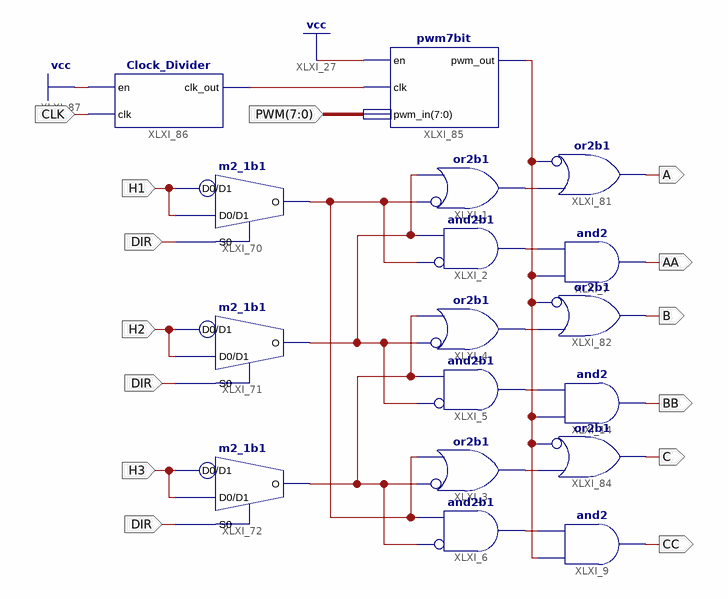
[diagram p0: schematic sheet 1]
// Xilinx ISE schematic openloop7bit.sch (spartan6) as structural Verilog: 17 symbols, 12 ports
module openloop7bit (
  input  [7:0] PWM,
  input  H1,
  input  H2,
  input  H3,
  input  DIR,
  input  CLK,
  output A,
  output AA,
  output B,
  output BB,
  output C,
  output CC
);

  wire H_1, H_2, H_3, XLXN_7, XLXN_8, XLXN_9, XLXN_10, XLXN_11, XLXN_12, XLXN_13, XLXN_29;

  or XLXI_1 (XLXN_7, ~H_1, H_2);  // or2b1
  and XLXI_2 (XLXN_10, ~H_1, H_2);  // and2b1
  or XLXI_3 (XLXN_9, ~H_3, H_1);  // or2b1
  or XLXI_4 (XLXN_8, ~H_2, H_3);  // or2b1
  and XLXI_5 (XLXN_11, ~H_2, H_3);  // and2b1
  and XLXI_6 (XLXN_12, ~H_3, H_1);  // and2b1
  m2_1b1 XLXI_70 (.D0(H1), .D1(H1), .S0(DIR), .O(H_1));
  m2_1b1 XLXI_71 (.D0(H2), .D1(H2), .S0(DIR), .O(H_2));
  m2_1b1 XLXI_72 (.D0(H3), .D1(H3), .S0(DIR), .O(H_3));
  and XLXI_7 (AA, XLXN_13, XLXN_10);
  and XLXI_14 (BB, XLXN_13, XLXN_11);
  and XLXI_9 (CC, XLXN_13, XLXN_12);
  or XLXI_81 (A, ~XLXN_13, XLXN_7);  // or2b1
  or XLXI_82 (B, ~XLXN_13, XLXN_8);  // or2b1
  or XLXI_84 (C, ~XLXN_13, XLXN_9);  // or2b1
  pwm7bit XLXI_85 (.en(1'b1), .clk(XLXN_29), .pwm_in(PWM), .pwm_out(XLXN_13));
  Clock_Divider XLXI_86 (.en(1'b1), .clk(CLK), .clk_out(XLXN_29));
endmodule
